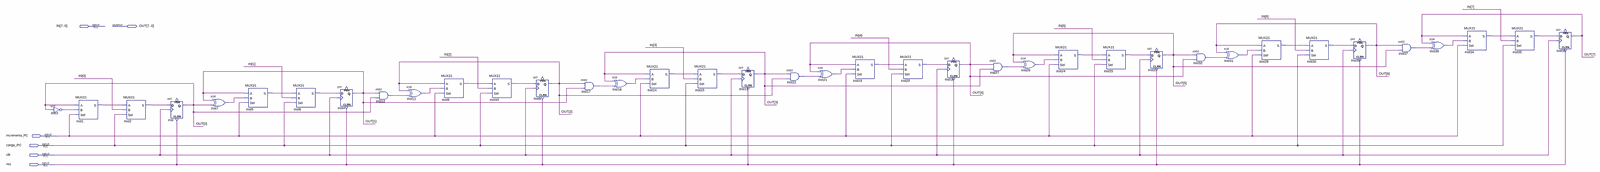
[diagram p0: schematic sheet, whole]
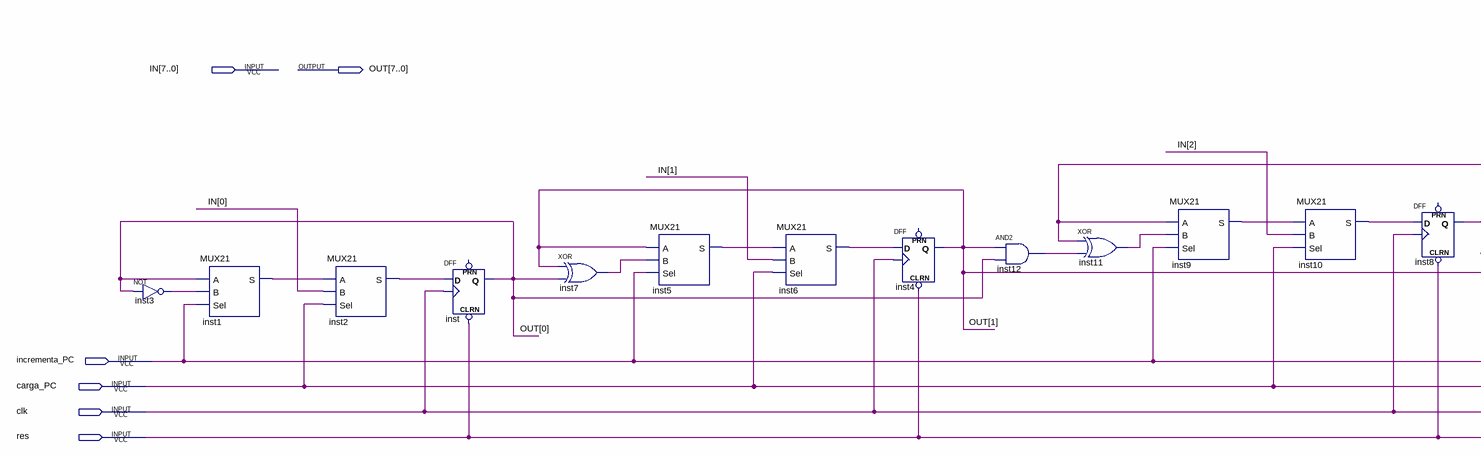
[diagram p1: schematic sheet, left part]
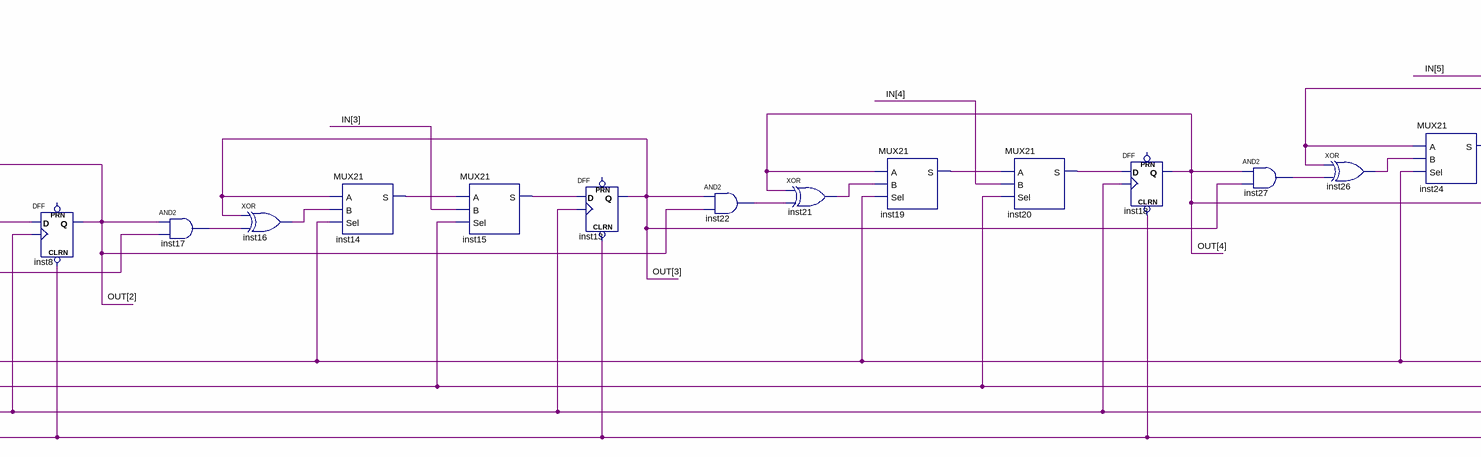
[diagram p2: schematic sheet, centre part]
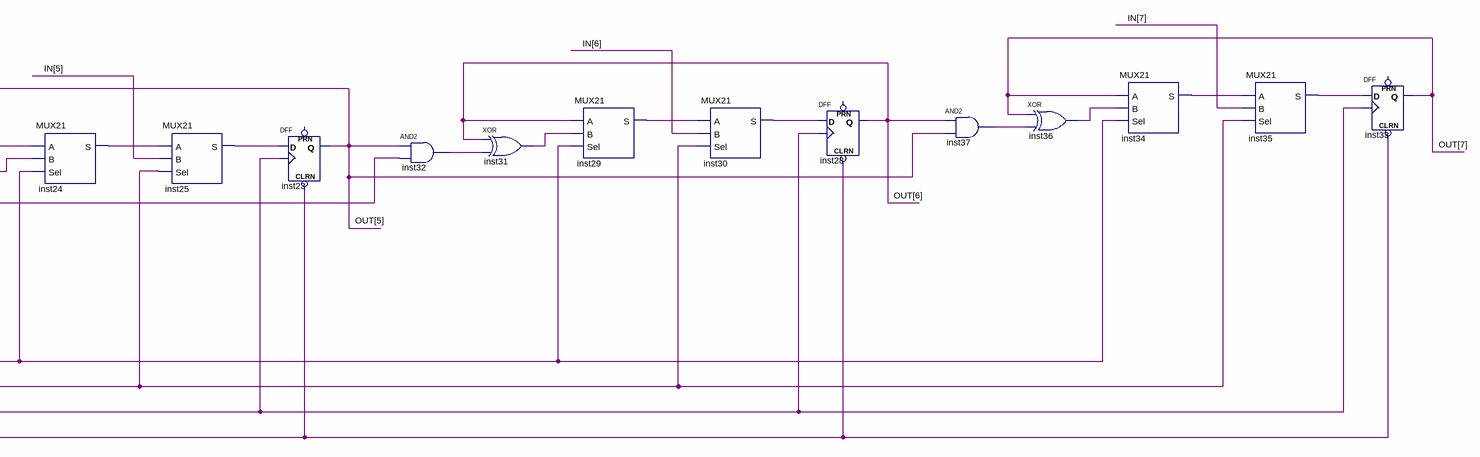
[diagram p3: schematic sheet, right part]
// Quartus schematic PC.bdf as structural Verilog: 38 symbols, 6 pins
module PC (
  input  [7:0] IN,
  input  incrementa_PC,
  input  carga_PC,
  input  clk,
  input  res,
  output [7:0] OUT
);

  wire inst1_s, inst2_s, inst3_out, inst5_s, inst6_s, inst7_out, inst9_s, inst10_s, inst11_out, inst12_out,
       inst14_s, inst15_s, inst16_out, inst17_out, inst19_s, inst20_s, inst21_out, inst22_out, inst24_s,
       inst25_s, inst26_out, inst27_out, inst29_s, inst30_s, inst31_out, inst32_out, inst34_s, inst35_s,
       inst36_out, inst37_out;

  not inst3 (inst3_out, OUT[0]);
  MUX21 inst1 (.A(OUT[0]), .B(inst3_out), .Sel(incrementa_PC), .S(inst1_s));
  MUX21 inst2 (.A(inst1_s), .B(IN[0]), .Sel(carga_PC), .S(inst2_s));
  DFF inst (.CLRN(res), .CLK(clk), .D(inst2_s), .Q(OUT[0]));  // open: PRN
  xor inst7 (inst7_out, OUT[1], OUT[0]);
  MUX21 inst5 (.A(OUT[1]), .B(inst7_out), .Sel(incrementa_PC), .S(inst5_s));
  MUX21 inst6 (.A(inst5_s), .B(IN[1]), .Sel(carga_PC), .S(inst6_s));
  DFF inst4 (.CLRN(res), .CLK(clk), .D(inst6_s), .Q(OUT[1]));  // open: PRN
  and inst12 (inst12_out, OUT[1], OUT[0]);
  xor inst11 (inst11_out, OUT[2], inst12_out);
  MUX21 inst9 (.A(OUT[2]), .B(inst11_out), .Sel(incrementa_PC), .S(inst9_s));
  MUX21 inst10 (.A(inst9_s), .B(IN[2]), .Sel(carga_PC), .S(inst10_s));
  DFF inst8 (.CLRN(res), .CLK(clk), .D(inst10_s), .Q(OUT[2]));  // open: PRN
  and inst17 (inst17_out, OUT[2], OUT[1]);
  xor inst16 (inst16_out, OUT[3], inst17_out);
  MUX21 inst14 (.A(OUT[3]), .B(inst16_out), .Sel(incrementa_PC), .S(inst14_s));
  MUX21 inst15 (.A(inst14_s), .B(IN[3]), .Sel(carga_PC), .S(inst15_s));
  DFF inst13 (.CLRN(res), .CLK(clk), .D(inst15_s), .Q(OUT[3]));  // open: PRN
  and inst22 (inst22_out, OUT[3], OUT[2]);
  xor inst21 (inst21_out, OUT[4], inst22_out);
  MUX21 inst19 (.A(OUT[4]), .B(inst21_out), .Sel(incrementa_PC), .S(inst19_s));
  MUX21 inst20 (.A(inst19_s), .B(IN[4]), .Sel(carga_PC), .S(inst20_s));
  DFF inst18 (.CLRN(res), .CLK(clk), .D(inst20_s), .Q(OUT[4]));  // open: PRN
  and inst27 (inst27_out, OUT[4], OUT[3]);
  xor inst26 (inst26_out, OUT[5], inst27_out);
  MUX21 inst24 (.A(OUT[5]), .B(inst26_out), .Sel(incrementa_PC), .S(inst24_s));
  MUX21 inst25 (.A(inst24_s), .B(IN[5]), .Sel(carga_PC), .S(inst25_s));
  DFF inst23 (.CLRN(res), .CLK(clk), .D(inst25_s), .Q(OUT[5]));  // open: PRN
  and inst32 (inst32_out, OUT[5], OUT[4]);
  xor inst31 (inst31_out, OUT[6], inst32_out);
  MUX21 inst29 (.A(OUT[6]), .B(inst31_out), .Sel(incrementa_PC), .S(inst29_s));
  MUX21 inst30 (.A(inst29_s), .B(IN[6]), .Sel(carga_PC), .S(inst30_s));
  DFF inst28 (.CLRN(res), .CLK(clk), .D(inst30_s), .Q(OUT[6]));  // open: PRN
  and inst37 (inst37_out, OUT[6], OUT[5]);
  xor inst36 (inst36_out, OUT[7], inst37_out);
  MUX21 inst34 (.A(OUT[7]), .B(inst36_out), .Sel(incrementa_PC), .S(inst34_s));
  MUX21 inst35 (.A(inst34_s), .B(IN[7]), .Sel(carga_PC), .S(inst35_s));
  DFF inst33 (.CLRN(res), .CLK(clk), .D(inst35_s), .Q(OUT[7]));  // open: PRN
endmodule
